# EAGLE schematic Analog signal processing sch (EAGLE 9.6.2)
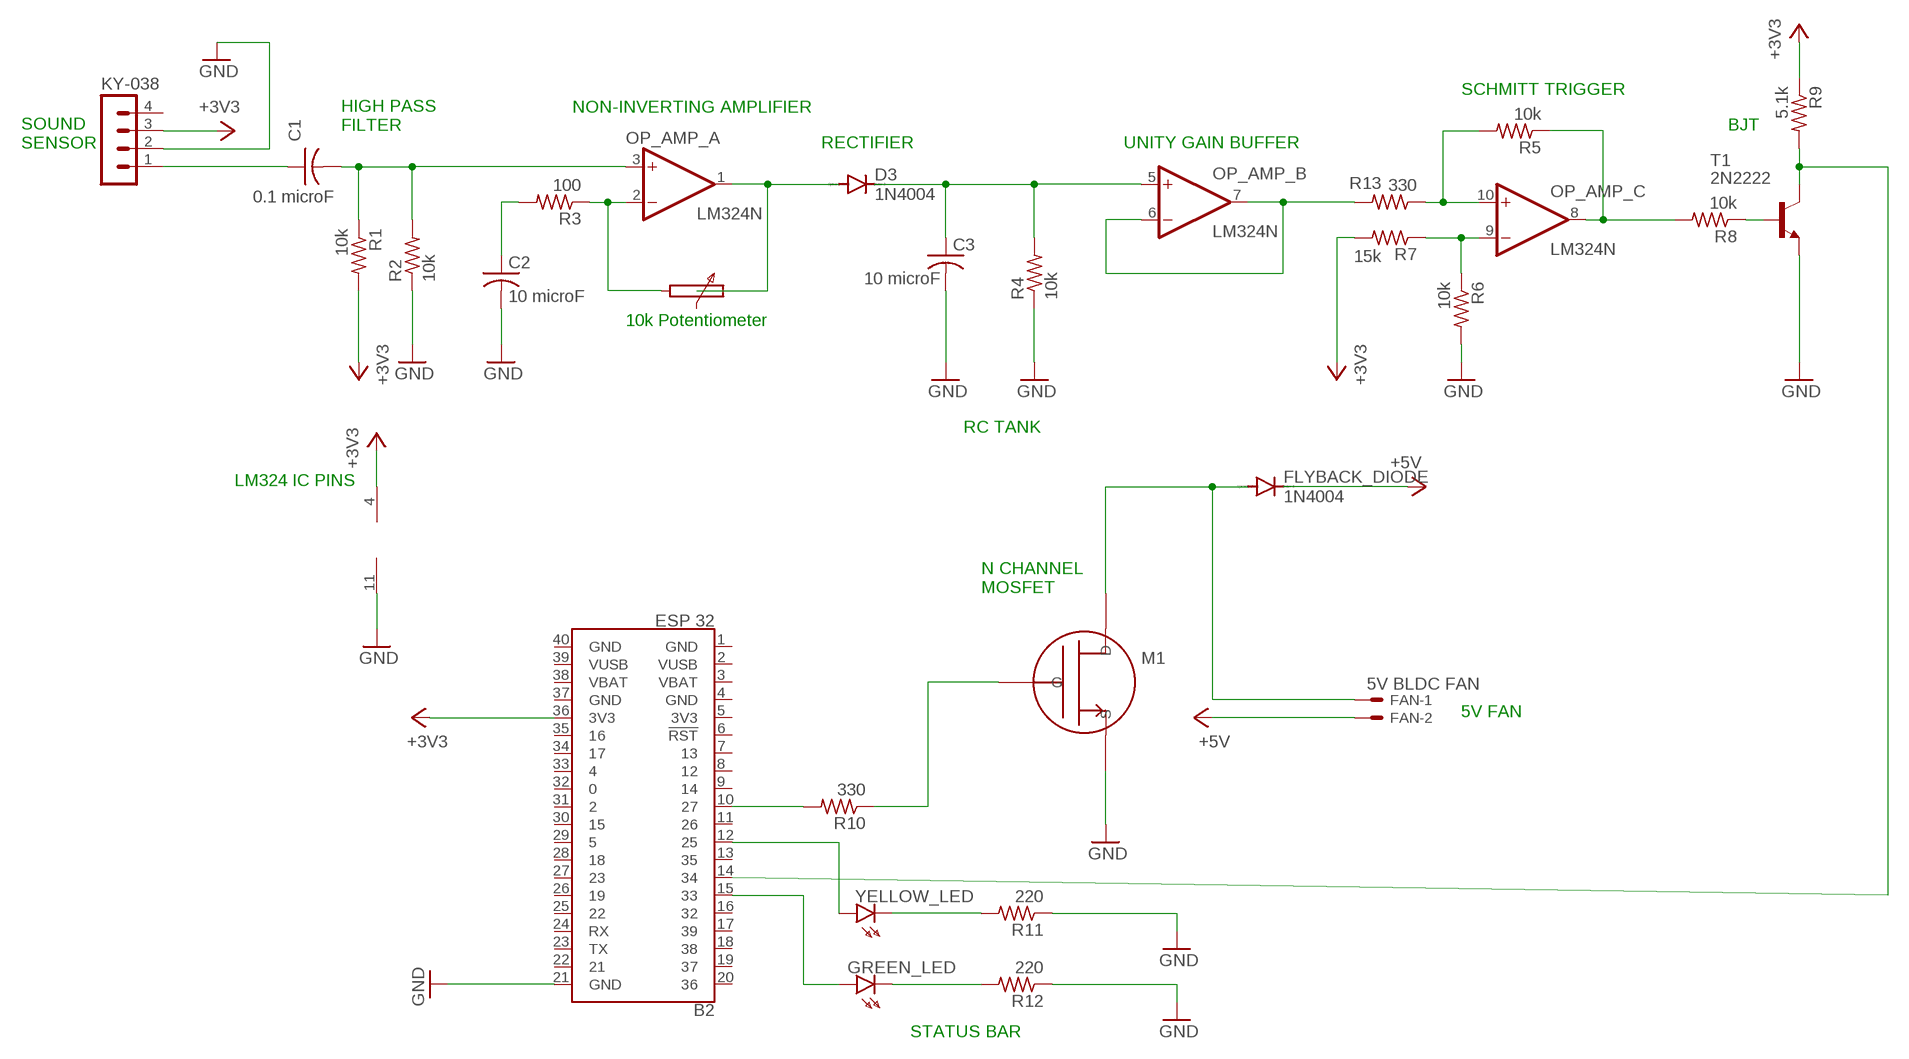
[diagram p0: schematic, sheet 1]

## Parts
B2  ESP 32  ESP32_THING_WO_ANT_KEEPOUT  [ESP32_THING_NO_ANT]
C1  0.1 microF  C-US025-024X044  [C025-024X044]
C2  10 microF  C-US025-024X044  [C025-024X044]
C3  10 microF  C-US025-024X044  [C025-024X044]
D3  1N4004  [DO41-10]
FAN  5V BLDC FAN  22-23-2021  [22-23-2021]
FLYBACK_DIODE  1N4004  [DO41-10]
GREEN_LED  HLMP6  [HLMP6]
KY-038  MA04-1  [MA04-1]
M1  FET_N  (no package)
OP_AMP_  LM324N  [DIL14]
R1  10k  R-US_0204/7  [0204/7]
R2  10k  R-US_0204/7  [0204/7]
R3  100  R-US_0204/7  [0204/7]
R4  10k  R-US_0204/7  [0204/7]
R5  10k  R-US_0204/7  [0204/7]
R6  10k  R-US_0204/7  [0204/7]
R7  15k  R-US_0204/7  [0204/7]
R8  10k  R-US_0204/7  [0204/7]
R9  5.1k  R-US_0204/7  [0204/7]
R10  330  R-US_0204/7  [0204/7]
R11  220  R-US_0204/7  [0204/7]
R12  220  R-US_0204/7  [0204/7]
R13  330  R-US_0204/7  [0204/7]
T1  2N2222  [TO18]
YELLOW_LED  HLMP6  [HLMP6]

## Nets
+3V3: B2.36(3V3) KY-038.3 OP_AMP_.4(P:V+) R1.2 R7.2 R9.1
+5V: FAN.2 FLYBACK_DIODE.C
GND: B2.21(GND) C2.2 C3.2 KY-038.2 M1.S OP_AMP_.11(P:V-) R2.1 R4.1 R6.2 R11.1 R12.1 T1.1(E)
N$1: C1.1 KY-038.1
N$2: C1.2 OP_AMP_.3(A:+IN) R1.1 R2.2
N$3: OP_AMP_.2(A:-IN) R3.1
N$4: D3.A OP_AMP_.1(A:OUT)
N$5: C2.1 R3.2
N$6: C3.1 D3.C OP_AMP_.5(B:+IN) R4.2
N$7: OP_AMP_.6(B:-IN) OP_AMP_.7(B:OUT) R13.2
N$8: OP_AMP_.8(C:OUT) R5.1 R8.2
N$9: R8.1 T1.2(B)
N$10: OP_AMP_.9(C:-IN) R6.1 R7.1
N$11: B2.14 R9.2 T1.3(C)
N$12: B2.10 R10.2
N$13: M1.G R10.1
N$14: OP_AMP_.10(C:+IN) R5.2 R13.1
N$15: FAN.1 FLYBACK_DIODE.A M1.D
N$16: B2.15 GREEN_LED.A
N$17: B2.12 YELLOW_LED.A
N$18: GREEN_LED.K R12.2
N$19: R11.2 YELLOW_LED.K
Unconnected: B2.1(GND) B2.2(VUSB) B2.3(VBAT) B2.4(GND) B2.5(3V3) B2.6(!RST!) B2.7 B2.8 B2.9 B2.11 B2.13 B2.16 B2.17 B2.18 B2.19 B2.20 B2.22 B2.23(TX) B2.24(RX) B2.25 B2.26 B2.27 B2.28 B2.29 B2.30 B2.31 B2.32 B2.33 B2.34 B2.35 B2.37(GND) B2.38(VBAT) B2.39(VUSB) B2.40(GND) KY-038.4 OP_AMP_.12(D:+IN) OP_AMP_.13(D:-IN) OP_AMP_.14(D:OUT)

## Notes on the sheet
- SCHMITT TRIGGER
- NON-INVERTING AMPLIFIER
- HIGH PASS
  FILTER
- BJT
- SOUND
  SENSOR
- RECTIFIER | UNITY GAIN BUFFER
- 10k Potentiometer
- RC TANK
- LM324 IC PINS
- N CHANNEL
  MOSFET
- 5V FAN
- STATUS BAR

## Library data of the parts
B2 = SparkFun-Boards:ESP32_THING: SparkFun ESP32 Thing Board Pins, silkscreen, and logos matching the layout of the SparkFun ESP32 Thing <https://www.sparkfun.com/products/13907> Dimensions: 2.32" x 1.00"
C1-C3 = rcl:C-US: CAPACITOR, American symbol; SPICEPREFIX: C
D3 FLYBACK_DIODE = diode:1N4004: DIODE general purpose rectifier, 1 A
FAN = con-molex:22-23-2021: .100" (2.54mm) Center Header - 2 Pin; MF: MOLEX; MPN: 22-23-2021; OC_FARNELL: 1462926; OC_NEWARK: 25C3832
GREEN_LED YELLOW_LED = display-hp:HLMP6: LED 2mm horizontal; MF: AGILENT TECHNOLOGIES; MPN: HLMP-6500; OC_FARNELL: 1652490; OC_NEWARK: 40K0088
KY-038 = con-lstb:MA04-1: PIN HEADER; OC_FARNELL: unknown; OC_NEWARK: unknown
M1 = ngspice-simulation:FET_N: N-Type MOS Field Effect Transistor (MOSFET)
OP_AMP_ = linear:LM324: OP AMP
R1-R13 = rcl:R-US_: RESISTOR, American symbol; SPICEPREFIX: R
T1 = transistor:2N2222: NPN TRANSISTOR